# Altium schematic sheet FPGA_misc.SchDoc
size A
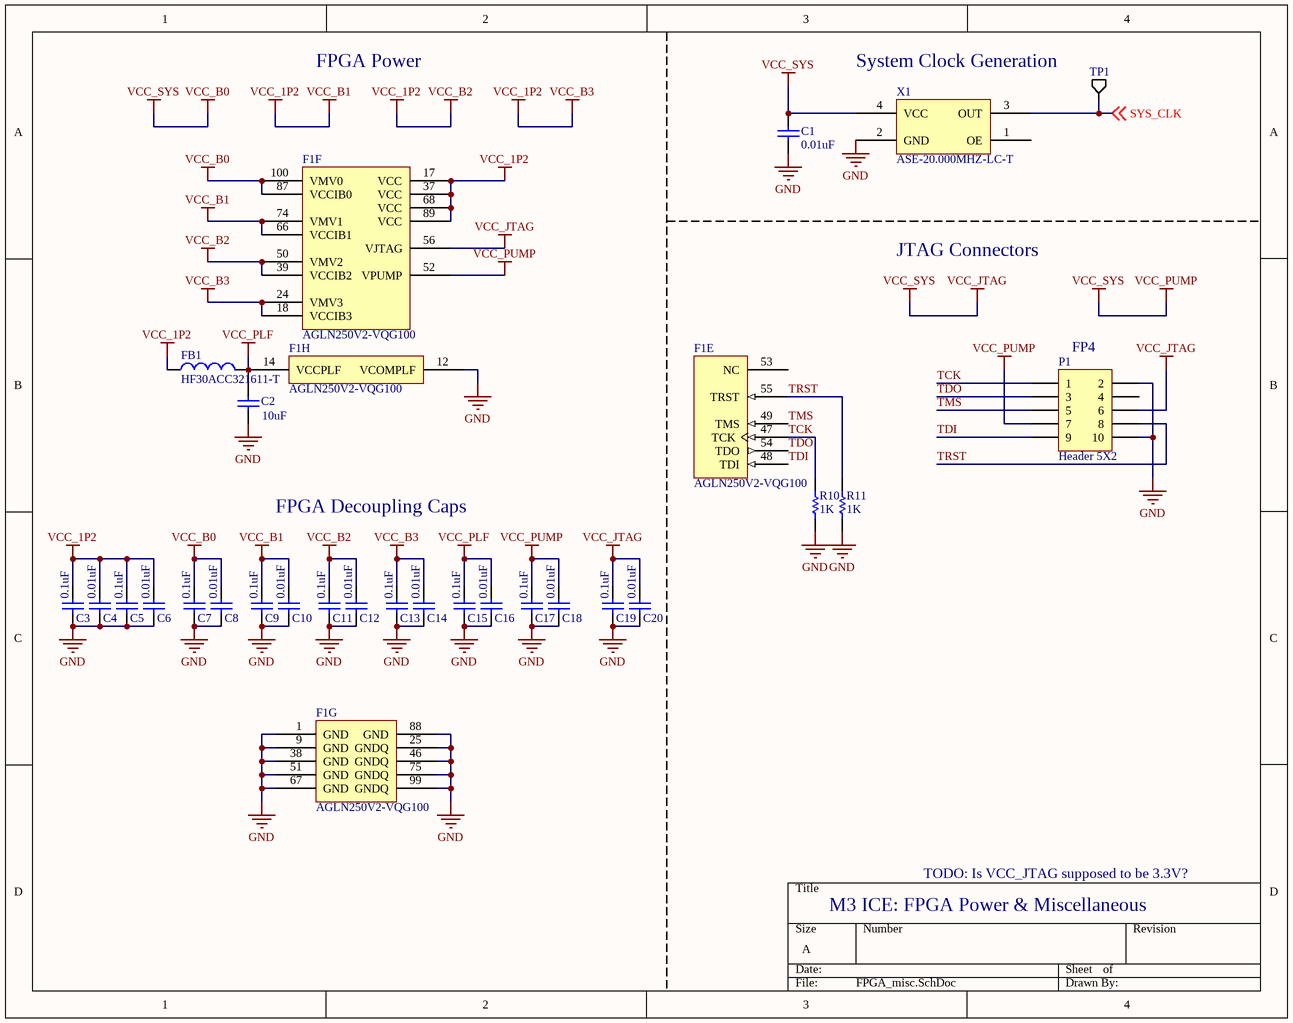
[diagram p0: FPGA_misc.SchDoc]

## Parts
C1  value 0.01uF  [1608[0603]]  (hidden comment: Cap Semi)
C2  value 10uF  [0805]  (hidden comment: Cap Chip)
C3  value 0.1uF  [1608[0603]]  (hidden comment: Cap Semi)
C4  value 0.01uF  [1608[0603]]  (hidden comment: Cap Semi)
C5  value 0.1uF  [1608[0603]]  (hidden comment: Cap Semi)
C6  value 0.01uF  [1608[0603]]  (hidden comment: Cap Semi)
C7  value 0.1uF  [1608[0603]]  (hidden comment: Cap Semi)
C8  value 0.01uF  [1608[0603]]  (hidden comment: Cap Semi)
C9  value 0.1uF  [1608[0603]]  (hidden comment: Cap Semi)
C10  value 0.01uF  [1608[0603]]  (hidden comment: Cap Semi)
C11  value 0.1uF  [1608[0603]]  (hidden comment: Cap Semi)
C12  value 0.01uF  [1608[0603]]  (hidden comment: Cap Semi)
C13  value 0.1uF  [1608[0603]]  (hidden comment: Cap Semi)
C14  value 0.01uF  [1608[0603]]  (hidden comment: Cap Semi)
C15  value 0.1uF  [1608[0603]]  (hidden comment: Cap Semi)
C16  value 0.01uF  [1608[0603]]  (hidden comment: Cap Semi)
C17  value 0.1uF  [1608[0603]]  (hidden comment: Cap Semi)
C18  value 0.01uF  [1608[0603]]  (hidden comment: Cap Semi)
C19  value 0.1uF  [1608[0603]]  (hidden comment: Cap Semi)
C20  value 0.01uF  [1608[0603]]  (hidden comment: Cap Semi)
F1  AGLN250V2-VQG100  [VQ100_N]  (parts E,F,G,H of 8)
FB1  HF30ACC321611-T  [Ferrite_Bead_3.2mm_1.6mm]
P1  Header 5X2  [HDR2X5]
R10  value 1K  [0603]  (hidden comment: Res Chip)
R11  value 1K  [0603]  (hidden comment: Res Chip)
TP1  TP  [TP]  (value not drawn)
X1  ASE-20.000MHZ-LC-T  [CRYSTAL_3.2mm_2.5mm]

## Nets
GND: C1.1 C2.1 C3.1 C4.1 C5.1 C6.1 C7.1 C8.1 C9.1 C10.1 C11.1 C12.1 C13.1 C14.1 C15.1 C16.1 C17.1 C18.1 C19.1 C20.1 F1.1(GND) F1.9(GND) F1.12(VCOMPLF) F1.25(GNDQ) F1.38(GND) F1.46(GNDQ) F1.51(GND) F1.67(GND) F1.75(GNDQ) F1.88(GND) F1.99(GNDQ) P1.2 P1.10 R10.2 R11.2 X1.2(GND)
VCC_1P2: C3.2 C4.2 C5.2 C6.2 C9.2 C10.2 C11.2 C12.2 C13.2 C14.2 F1.17(VCC) F1.18(VCCIB3) F1.24(VMV3) F1.37(VCC) F1.39(VCCIB2) F1.50(VMV2) F1.66(VCCIB1) F1.68(VCC) F1.74(VMV1) F1.89(VCC) FB1.1  [also labelled VCC_B1, VCC_B2, VCC_B3]
VCC_B0: C1.2 C7.2 C8.2 C17.2 C18.2 C19.2 C20.2 F1.52(VPUMP) F1.56(VJTAG) F1.87(VCCIB0) F1.100(VMV0) P1.6 P1.7 X1.4(VCC)  [also labelled VCC_JTAG, VCC_PUMP, VCC_SYS]
VCC_PLF: C2.2 C15.2 C16.2 F1.14(VCCPLF) FB1.2
SYS_CLK: TP1.1(A) X1.3(OUT) ; off-sheet SYS_CLK
TCK: F1.47(TCK) P1.1 R10.1
TDI: F1.48(TDI) P1.9
TDO: F1.54(TDO) P1.3
TMS: F1.49(TMS) P1.5
TRST: F1.55(TRST) P1.8 R11.1

Not connected (* = marked no-connect by the designer): F1 53(NC); P1 4; X1 1(OE)

## Notes on the sheet
- FPGA Power
- System Clock Generation
- JTAG Connectors
- (near P1) FP4
- FPGA Decoupling Caps
- M3 ICE: FPGA Power & Miscellaneous
- TODO: Is VCC_JTAG supposed to be 3.3V?

## Library data of the parts
C1 C4 C6 C8 C10 C12 C14 C16 C18 C20 = Cap Semi: Capacitor (Semiconductor SIM Model); DistPartNo: 445-1311-1-ND; ManPartNo: C1608X7R1H103K; Published: 8-Jun-2000; LatestRevisionDate: 29-May-2009; LatestRevisionNote: IPC-7351 Footprint Added.; PackageReference: C1206; Publisher: Altium Limited; PackageDescription: Chip Capacitor
C2 = Cap Chip: Capacitor (Semiconductor SIM Model); DistPartNo: 445-7645-1-ND; ManPartNo: C2012X5R1C106M/0.85; Published: 8-Jun-2000; LatestRevisionDate: 29-May-2009; LatestRevisionNote: IPC-7351 Footprint Added.; PackageReference: C1206; Publisher: Altium Limited; PackageDescription: Chip Capacitor
C3 C5 C7 C9 C11 C13 C15 C17 C19 = Cap Semi: Capacitor (Semiconductor SIM Model); DistPartNo: 445-1317-1-ND; ManPartNo: C1608X7R1C104K; Published: 8-Jun-2000; LatestRevisionDate: 29-May-2009; LatestRevisionNote: IPC-7351 Footprint Added.; PackageReference: C1206; Publisher: Altium Limited; PackageDescription: Chip Capacitor
F1 = AGLN250V2-VQG100: IGLOO nano Low-Power Flash 1.2 to 1.5V FPGA with Flash*Freeze, 68 User IOs, 250K System Gates, 1Kbit Flash ROM, 100-Pin TQFP, Commercial Grade, Pb-Free; DistPartNo: 1100-1134-ND; Published: 29-May-2009; DatasheetVersion: Feb-2009; PackageVersion: v11.0, Feb-2009; PackageReference: VQ100; Publisher: Altium Limited; PackageDescription: 100-Pin Plastic Quad Flat Pack (VQ100); Code_JEDEC: MS-026-AED; ComponentLink1Description: Manufacturer Link; ComponentLink1URL: http://www.actel.com/products/igloonano/default.aspx; ComponentLink2Description: Datasheet; ComponentLink2URL: http://www.actel.com/documents/IGLOO_nano_DS.pdf; ManPartNo: AGLN250V2-VQG100
FB1 = Ferrite Bead HF30ACC321611-T: DistPartNo: 445-6165-1-ND; ManPartNo: HF30ACC321611-T
P1 = Header 5X2: Header, 5-Pin, Dual row; LatestRevisionDate: 17-Jul-2002; LatestRevisionNote: Re-released for DXP Platform.; Publisher: Altium Limited
R10 R11 = Res Chip: Semiconductor Resistor; DistPartNo: P1.0KGCT-ND; ManPartNo: ERJ-3GEYJ102V; Published: 8-Jun-2000; LatestRevisionDate: 17-Jul-2002; LatestRevisionNote: Re-released for DXP Platform.; PackageReference: AXIAL-0.5; Publisher: Altium Limited; PackageDescription: Axial Device, Thru-Hole; 2 Leads; 0.5 in Pin Spacing
X1 = ASE-20.000MHZ-LC-T: DistPartNo: 535-9565-1-ND; ManPartNo: ASE-20.000MHZ-LC-T